# EAGLE design Micromouse2 (EAGLE 6.3)
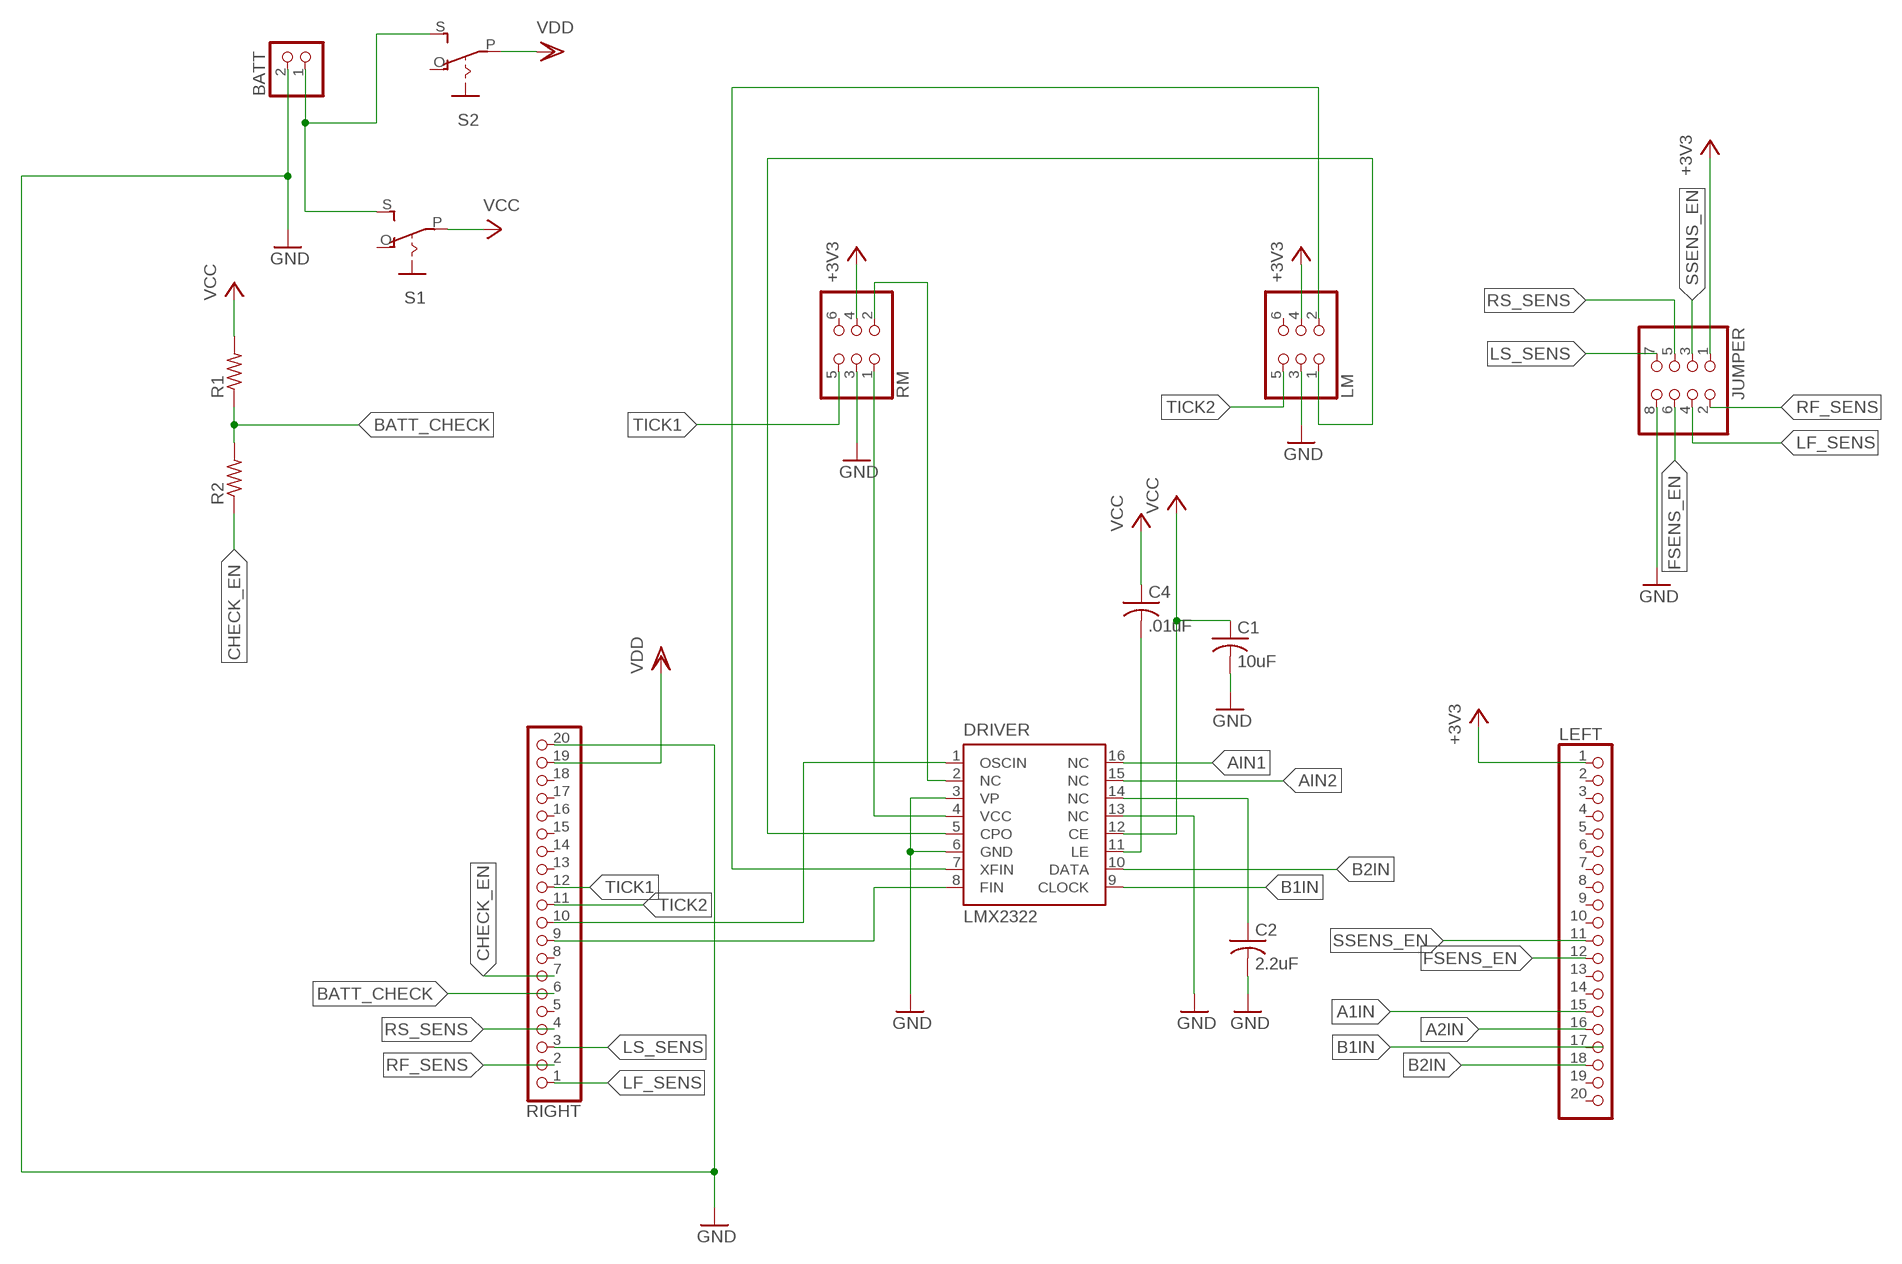
[diagram p0: schematic, sheet 1]

## Parts
BATT  JST_2PIN-THM  [JST-PH-2-THM]
C1  10uF  C-USC0805  [C0805]
C2  2.2uF  C-USC0805  [C0805]
C4  .01uF  C-USC0805  [C0805]
DRIVER  LMX2322  [TSSOP16]
JUMPER  PINHD-2X4  [2X04]
LEFT  PINHD-1X20  [1X20]
LM  PINHD-2X3  [2X03]
R1  R-US_R0805  [R0805]
R2  R-US_R0805  [R0805]
RIGHT  PINHD-1X20  [1X20]
RM  PINHD-2X3  [2X03]
S1  EG1218S  [EG1218]
S2  EG1218S  [EG1218]

## Nets
+3V3: JUMPER.1 LEFT.1 LM.4 RM.4
A1IN: LEFT.15
A2IN: LEFT.16
AIN1: DRIVER.16(NC)
AIN2: DRIVER.15(NC)
B1IN: DRIVER.9(CLOCK)
B2IN: DRIVER.10(DATA) LEFT.18
BATT_CHECK: R1.1 R2.2 RIGHT.6
CHECK_EN: R2.1 RIGHT.7
FSENS_EN: JUMPER.6 LEFT.12
GND: BATT.2 C1.2 C2.2 DRIVER.3(VP) DRIVER.6(GND) DRIVER.13(NC) JUMPER.8 LM.3 RIGHT.20 RM.3
LF_SENS: JUMPER.4 RIGHT.1
LS_SENS: JUMPER.7 RIGHT.3
N$1: DRIVER.2(NC) RM.2
N$2: C2.1 DRIVER.14(NC)
N$3: DRIVER.4(VCC) RM.1
N$4: C4.2 DRIVER.11(LE)
N$5: DRIVER.7(XFIN) LM.2
N$6: DRIVER.5(CPO) LM.1
N$7: BATT.1 S1.S S2.S
N$8: DRIVER.8(FIN) RIGHT.9
N$9: DRIVER.1(OSCIN) RIGHT.10
RF_SENS: JUMPER.2 RIGHT.2
RS_SENS: JUMPER.5 RIGHT.4
SSENS_EN: JUMPER.3 LEFT.11
TICK1: RIGHT.12 RM.5
TICK2: LM.5 RIGHT.11
VCC: C1.1 C4.1 DRIVER.12(CE) R1.2 S1.P
VDD: RIGHT.19 S2.P
Unconnected: LEFT.2 LEFT.3 LEFT.4 LEFT.5 LEFT.6 LEFT.7 LEFT.8 LEFT.9 LEFT.10 LEFT.13 LEFT.14 LEFT.17 LEFT.19 LEFT.20 LM.6 RIGHT.5 RIGHT.8 RIGHT.13 RIGHT.14 RIGHT.15 RIGHT.16 RIGHT.17 RIGHT.18 RM.6 S1.O S2.O

## Library data of the parts
BATT = adafruit:JST_2PIN: JST 2-Pin Connectors of various flavors SMT-RA (S2B-PH-SM4) 4UConnector #17311 SMT (B2B-PH-SM4) THM-RA (S2B-PH) THM (B2B-PH)
C1 C2 C4 = adafruit:C-US: CAPACITOR, American symbol
DRIVER = national-semiconductor:LMX2322: PLLatinumTM 2.0 GHz Frequency Synthesizer for RF Personal Communications Source: LMX2322.pdf; OC_FARNELL: unknown; OC_NEWARK: unknown
JUMPER = pinhead:PINHD-2X4: PIN HEADER
LEFT RIGHT = adafruit:PINHD-1X20: PIN HEADER
LM RM = pinhead:PINHD-2X3: PIN HEADER
R1 R2 = adafruit:R-US_: RESISTOR, American symbol
S1 S2 = adafruit:EG1218: SLIDING SWITCH 0.1" spacing through hole, vertical SPDT slide switch http://www.ladyada.net/library/pcb/eaglelibrary.html

## Board
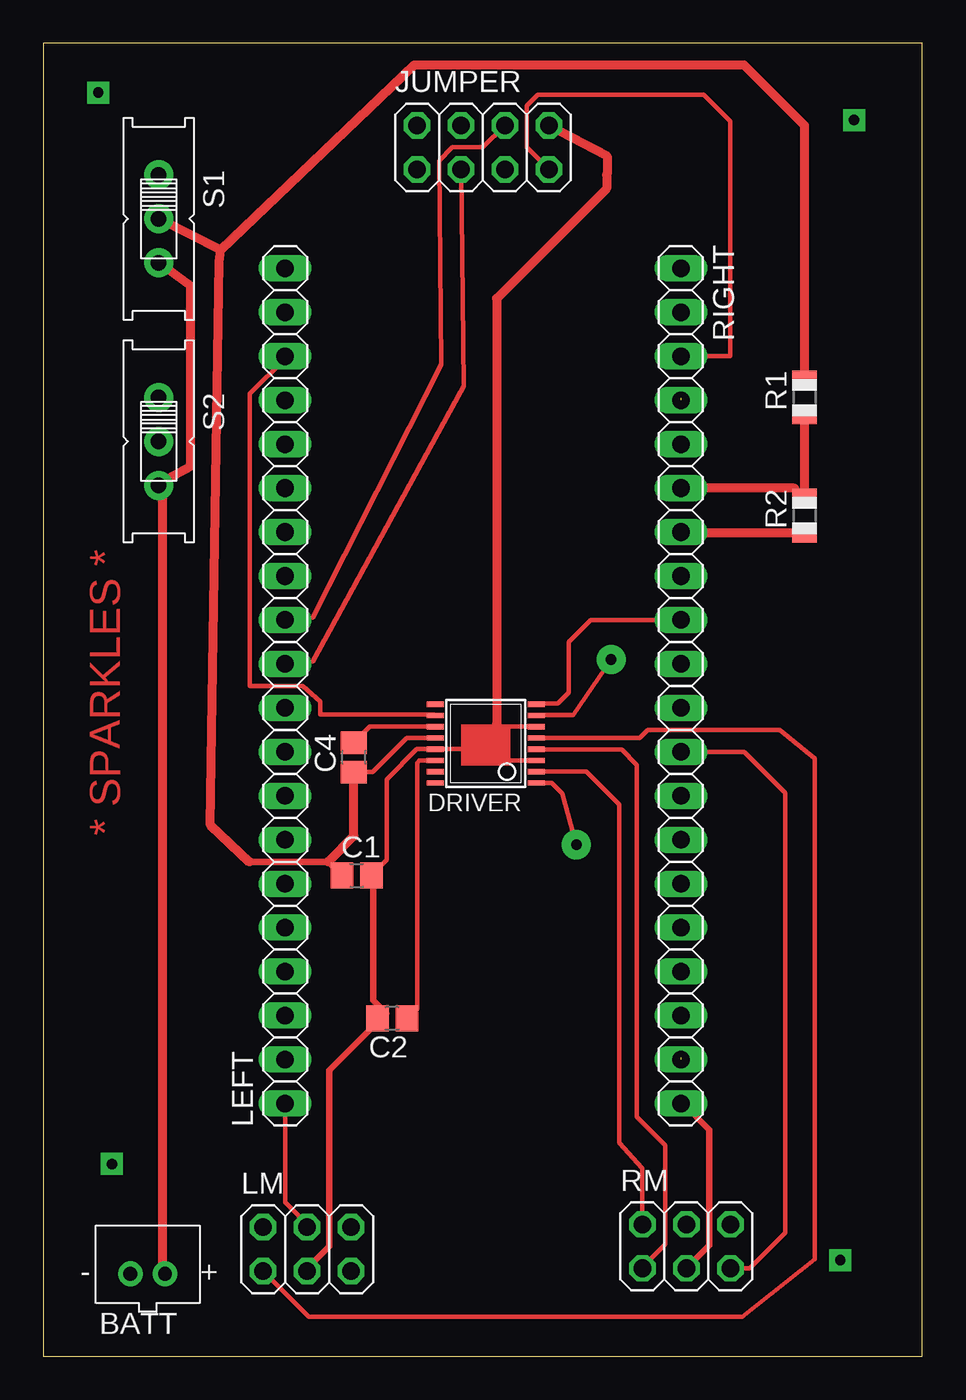
[diagram p1: board, top side]
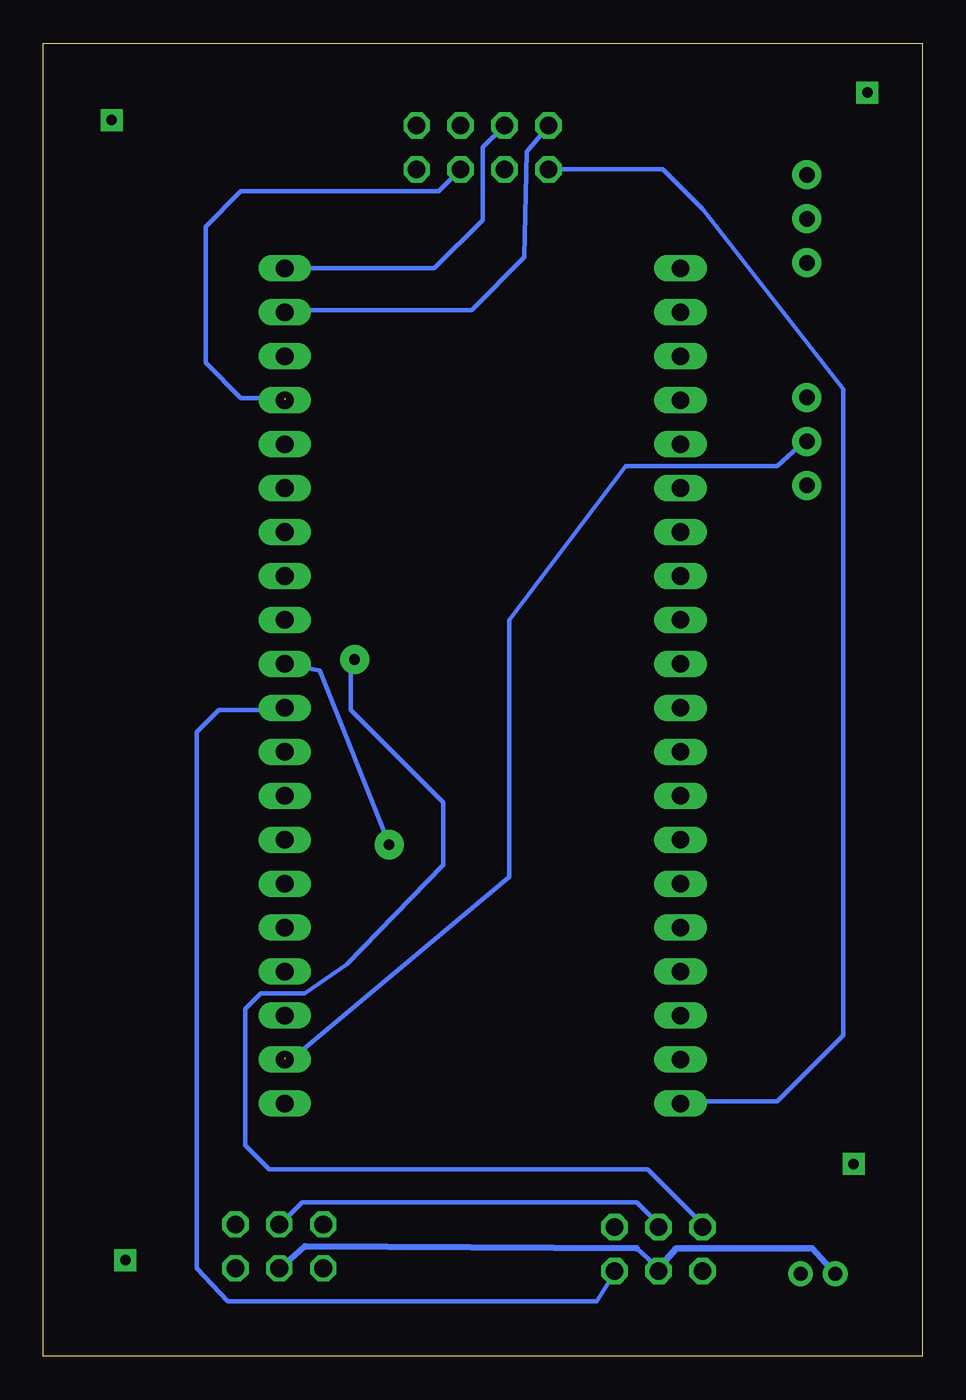
[diagram p2: board, bottom side, seen from below]

Size 50.78 x 75.87 mm. Coordinates in mm from the lower left corner, seen from the top.
Outline: 0,0 50.78,0 50.78,75.87 0,75.87 0,0
Copper layers (1*16): Top 0.035mm / dielectric 1.5mm / Bottom 0.035mm
Design rules "default": minimum track width 10mil, minimum drill 24mil, track to track 8mil, track to pad 8mil, pad to pad 8mil, via to via 8mil, smd to smd 8mil, copper to edge 40mil, drill to drill 8mil, minimum pad ring 10mil, minimum via ring 8mil, stop-mask expansion 4mil, vias tented up to drill 0mil, thermal gap 10mil

### Footprints (pad centres in the part's own frame; a part is rotated, then mirrored left to right if it is on the bottom)
JST-PH-2-THM = drill 0.8 pad 1.422: 1 1,0; 2 -1,0
C0805 = smd 1.3 x 1.5: 1 -0.85,0; 2 0.85,0
TSSOP16 = smd 0.305 x 0.991: 1 -2.275,-2.918; 2 -1.625,-2.918; 3 -0.975,-2.918; 4 -0.325,-2.918; 5 0.325,-2.918; 6 0.975,-2.918; 7 1.625,-2.918; 8 2.275,-2.918; 9 2.275,2.918; 10 1.625,2.918; 11 0.975,2.918; 12 0.325,2.918; 13 -0.325,2.918; 14 -0.975,2.918; 15 -1.625,2.918; 16 -2.275,2.918
2X04 = drill 1.016 octagon: 1 -3.81,-1.27; 2 -3.81,1.27; 3 -1.27,-1.27; 4 -1.27,1.27; 5 1.27,-1.27; 6 1.27,1.27; 7 3.81,-1.27; 8 3.81,1.27
1X20 = drill 1.016 long: 1 -24.13,0; 2 -21.59,0; 3 -19.05,0; 4 -16.51,0; 5 -13.97,0; 6 -11.43,0; 7 -8.89,0; 8 -6.35,0; 9 -3.81,0; 10 -1.27,0; 11 1.27,0; 12 3.81,0; 13 6.35,0; 14 8.89,0; 15 11.43,0; 16 13.97,0; 17 16.51,0; 18 19.05,0; 19 21.59,0; 20 24.13,0
2X03 = drill 1.016 octagon: 1 -2.54,-1.27; 2 -2.54,1.27; 3 0,-1.27; 4 0,1.27; 5 2.54,-1.27; 6 2.54,1.27
R0805 = smd 1.1 x 1.4: 1 -1,0; 2 1,0
EG1218 = drill 0.9 pad 1.676: O -2.54,0; P 0,0; S 2.54,0

### Placement (x,y rotation side)
BATT  6.03,4.76 0 top
C1  18.1,27.78 0 top
C2  20.16,19.53 180 top
C4  17.94,34.61 90 top
DRIVER  25.56,35.4 90 top
JUMPER  25.4,69.85 0 top
LEFT  13.97,38.73 90 top
LM  15.24,6.19 0 top
R1  43.97,55.4 90 top
R2  43.97,48.58 90 top
RIGHT  36.83,38.73 270 top
RM  37.15,6.35 0 top
S1  6.67,65.72 270 top
S2  6.67,52.86 270 top

### Tracks (layer width: path | path; a pad name or v marks a point on that pad's centre or on a via)
+3V3
  Top 0.254: LEFT.1 13.97,8.89 15.24,7.62 LM.4
  Bottom 0.254: RM.4 37.08,7.62 35.81,8.89 16.51,8.89 15.24,7.62 LM.4 | LEFT.1 13.97,14.73 8.38,14.73 4.57,18.54 4.57,55.88 12.7,66.29 14.99,68.58 JUMPER.1
B2IN
  Top 0.254: LEFT.18 13.97,57.66 11.94,55.63 11.94,38.73 14.99,38.73 16,37.85 16,37.08 22.58,37.08 arc-90 DRIVER.10
BATT_CHECK
  Top 0.254: R2.2 43.39,50.16
  Top 0.508: R2.2 R1.1 | 43.39,50.16 RIGHT.6
CHECK_EN
  Top 0.254: 36.51,47.62 36.35,47.78 36.32,47.75 36.83,47.75 RIGHT.7 36.88,47.58
  Top 0.508: R2.1 36.88,47.58
FSENS_EN
  Top 0.254: LEFT.12 15.56,42.67 22.99,57.31 22.86,69.09 23.62,69.85 25.4,69.85 JUMPER.6
GND
  Top 0.254: 22.61,35.05 DRIVER.13 | 19.81,19.81 19.56,19.56 C2.2 19.3,19.3 | 15.24,5.08 LM.3 | 36.83,14.73 RIGHT.20 36.96,14.61 | DRIVER.13 21.58,35.08 19.84,33.34 19.84,28.68 C1.2 19.05,27.68 | DRIVER.13 24.45,35.08 24.61,34.92 24.61,35.72 25.47,35.72 26.23,36.48 | 26.23,36.48 26.23,34.92 26.19,34.92 26.19,34.54 26.31,34.43 DRIVER.3 | 32.58,68.29 32.54,68.26 | 26.19,36.51 26.23,36.48 | 26.23,36.48 26.33,36.38 DRIVER.6
  Top 0.381: 15.24,5.08 16.51,6.35 16.51,16.51 19.3,19.3 | 19.81,19.81 19.05,20.57 19.05,27.68 | RM.3 38.48,6.41 38.48,13.08 36.96,14.61
  Top 0.508: JUMPER.8 32.58,69.34 32.58,68.29 | 32.54,68.26 32.54,67.47 26.19,61.12 26.19,36.51
  Bottom 0.254: 5.08,4.83 BATT.2 | 16.51,6.22 15.24,5.08 LM.3 | 37.08,5.08 RM.3
  Bottom 0.381: 5.08,4.83 6.35,6.22 14.22,6.22 15.24,5.08 | 16.51,6.22 35.69,6.35 37.08,5.08
LF_SENS
  Bottom 0.254: JUMPER.4 25.4,69.85 25.4,65.66 28.19,62.87 RIGHT.1 36.83,62.99
LS_SENS
  Top 0.254: JUMPER.7 27.94,69.85 27.94,72.26 28.57,72.9 38.16,72.9 39.69,71.37 39.69,57.78 RIGHT.3 36.83,57.91
N$1
  Top 0.254: RM.2 34.61,10.86 33.27,12.32 33.27,31.88 31.37,33.78 DRIVER.2
N$2
  Top 0.254: C2.1 21.08,19.56 21.59,20.07 21.59,34.29 21.73,34.43 DRIVER.14
N$3
  Top 0.254: DRIVER.4 28.45,35.05 33.4,35.05 34.29,34.16 34.29,13.84 35.94,12.19 35.94,6.48 34.54,5.08 RM.1
N$4
  Top 0.254: C4.2 18.86,36.38 DRIVER.11 22.81,36.38 arc-90 22.86,36.32
N$5  (via drill 0.61 pad 1.68)
  Top 0.254: v32.8,40.26 30.61,37.05 28.5,37.05 arc90 DRIVER.7
  Bottom 0.254: LM.2 12.7,7.62 15.88,10.79 37.72,10.79 39.12,12.19 39.12,20.07 38.23,20.95 35.69,20.95 33.24,22.64 27.69,28.38 27.69,32 33.02,37.34 33.02,39.47 v32.8,40.26
N$6
  Top 0.254: DRIVER.5 34.46,35.73 34.92,36.2 42.55,36.2 44.58,34.54 44.58,5.59 40.39,2.29 15.34,2.29 LM.1
N$7
  Top 0.254: 6.86,4.83 BATT.1 | 6.86,50.29 S2.S 6.86,50.55
  Top 0.508: 6.86,50.29 6.86,4.83 | S1.S 8.51,61.85 8.51,51.44 6.86,50.55
N$8
  Top 0.254: DRIVER.8 28.52,37.72 29.72,37.72 30.35,38.35 30.35,41.27 31.62,42.55 RIGHT.9
N$9  (via drill 0.61 pad 1.68)
  Top 0.254: v30.8,29.56 29.97,32.51 29.36,33.13 DRIVER.1
  Bottom 0.254: 36.83,39.88 RIGHT.10 34.8,39.62 v30.8,29.56
N$10  (via drill 0.6 pad 1.27)
  other vias: 3.17,73.03
N$11  (via drill 0.6 pad 1.27)
  other vias: 46.83,71.44
N$12  (via drill 0.6 pad 1.27)
  other vias: 46.04,5.56
N$13  (via drill 0.6 pad 1.27)
  other vias: 3.97,11.11
RF_SENS
  Bottom 0.254: RIGHT.2 36.83,60.45 26.04,60.45 22.99,63.5 22.86,69.6 JUMPER.2
RS_SENS  (1 unrouted)
  Bottom 0.254: JUMPER.5 27.94,67.31 39.37,67.31 41.4,65.28 41.4,57.4 39.37,55.37 36.83,55.37
SSENS_EN
  Top 0.254: JUMPER.3 24.29,56.07 15.56,40.13 LEFT.11
TICK1
  Top 0.254: 36.83,34.8 RIGHT.12 40.48,34.92 42.86,32.54 42.86,7.14 40.8,5.08 RM.5
TICK2
  Bottom 0.254: LM.5 17.78,4.83 18.8,3.17 40.13,3.17 41.91,5.08 41.91,36.07 40.64,37.34 36.96,37.34 RIGHT.11
VCC
  Top 0.254: C4.1 19.03,33.76 20.99,35.73 DRIVER.12
  Top 0.381: 11.91,28.57 16.45,28.57 C1.1
  Top 0.508: 10.24,63.93 10.16,63.25 9.65,30.7 11.91,28.57 | 10.24,63.93 S1.P | R1.2 43.97,71.12 40.48,74.61 21.43,74.61 10.24,63.93 | 16.45,28.57 17.94,30.06 C4.1
VDD  (1 unrouted)
  Bottom 0.254: S2.P 6.86,52.83 8.38,51.44 17.14,51.44 23.88,42.55 23.88,27.69 36.32,17.27 36.83,17.27
(copper drawn outside any net)
  shapes: Top area x1

### Text on the board
Top: * SPARKLES *